# EAGLE design gate_boost (EAGLE 6.6.0)
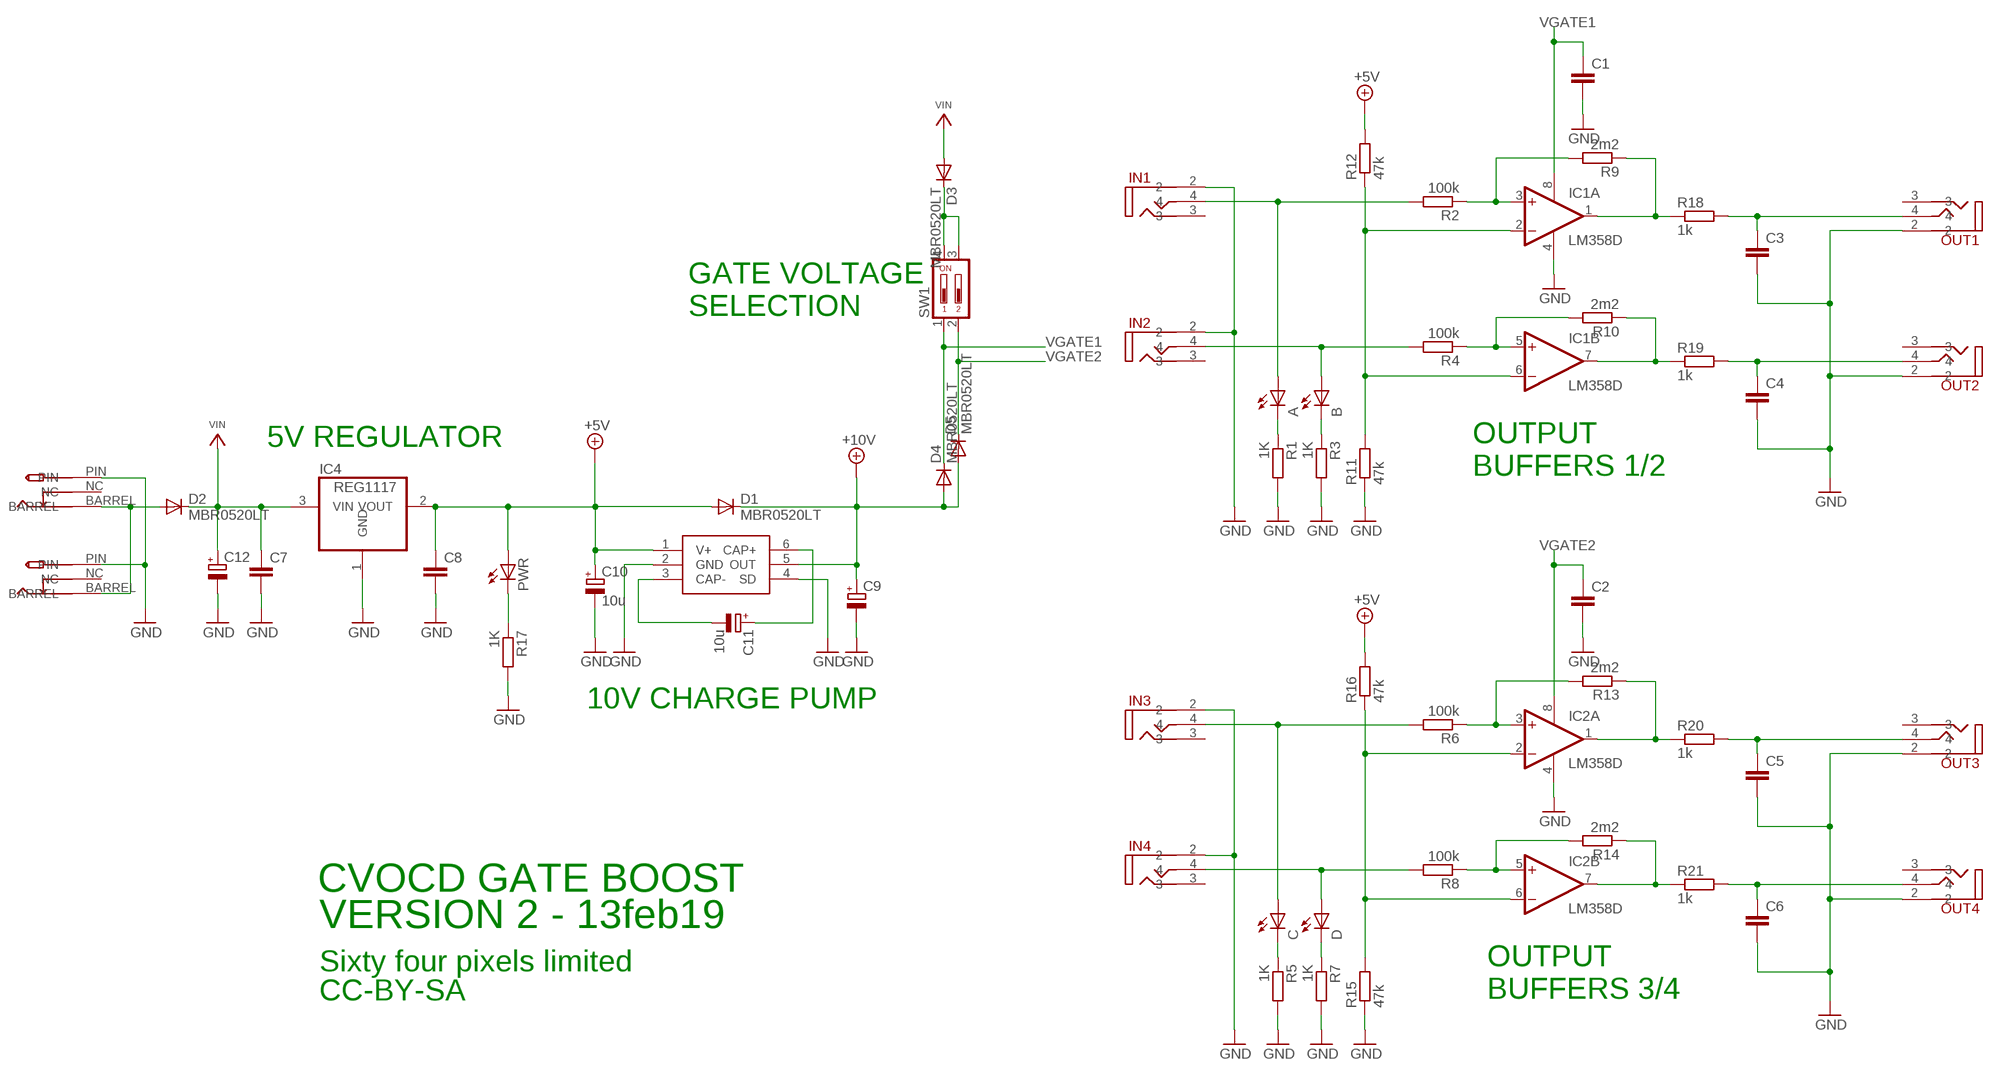
[diagram p0: schematic, sheet 1]

## Parts
A  LED3MM  [LED3MM]
B  LED3MM  [LED3MM]
C  LED3MM  [LED3MM]
C1  C-EUC0805  [C0805]
C2  C-EUC0805  [C0805]
C3  C-EUC0805  [C0805]
C4  C-EUC0805  [C0805]
C5  C-EUC0805  [C0805]
C6  C-EUC0805  [C0805]
C7  C-EUC0805  [C0805]
C8  C-EUC0805  [C0805]
C9  CPOL-EUSMCA  [SMC_A]
C10  10u  CPOL-EUSMCA  [SMC_A]
C11  10u  CPOL-EUSMCA  [SMC_A]
C12  CPOL-EUE2-5  [E2-5]
D  LED3MM  [LED3MM]
D1  MBR0520LT  [SOD123]
D2  MBR0520LT  [SOD123]
D3  MBR0520LT  [SOD123]
D4  MBR0520LT  [SOD123]
D5  MBR0520LT  [SOD123]
IC1  LM358D  [SO08]
IC2  LM358D  [SO08]
IC3  LM27675M5_CHARGEPUMP  [SOT23-6]
IC4  REG1117  [SOT223]
IN1  VERTICAL_3_5MM_SOCKET  [VERTICAL_3_5MM_SOCKET]
IN2  VERTICAL_3_5MM_SOCKET  [VERTICAL_3_5MM_SOCKET]
IN3  VERTICAL_3_5MM_SOCKET  [VERTICAL_3_5MM_SOCKET]
IN4  VERTICAL_3_5MM_SOCKET  [VERTICAL_3_5MM_SOCKET]
OUT1  VERTICAL_3_5MM_SOCKET  [VERTICAL_3_5MM_SOCKET]
OUT2  VERTICAL_3_5MM_SOCKET  [VERTICAL_3_5MM_SOCKET]
OUT3  VERTICAL_3_5MM_SOCKET  [VERTICAL_3_5MM_SOCKET]
OUT4  VERTICAL_3_5MM_SOCKET  [VERTICAL_3_5MM_SOCKET]
PWR  LED3MM  [LED3MM]
R1  1K  R-EU_R0805  [R0805]
R2  100k  R-EU_R0805  [R0805]
R3  1K  R-EU_R0805  [R0805]
R4  100k  R-EU_R0805  [R0805]
R5  1K  R-EU_R0805  [R0805]
R6  100k  R-EU_R0805  [R0805]
R7  1K  R-EU_R0805  [R0805]
R8  100k  R-EU_R0805  [R0805]
R9  2m2  R-EU_R0805  [R0805]
R10  2m2  R-EU_R0805  [R0805]
R11  47k  R-EU_R0805  [R0805]
R12  47k  R-EU_R0805  [R0805]
R13  2m2  R-EU_R0805  [R0805]
R14  2m2  R-EU_R0805  [R0805]
R15  47k  R-EU_R0805  [R0805]
R16  47k  R-EU_R0805  [R0805]
R17  1K  R-EU_R0805  [R0805]
R18  1k  R-EU_R0805  [R0805]
R19  1k  R-EU_R0805  [R0805]
R20  1k  R-EU_R0805  [R0805]
R21  1k  R-EU_R0805  [R0805]
SW1  DIP02YL  [DIP02YL]
U$1  PWR_SOCKET_2_1MM  [PWR_SOCKET_2_1MM]
U$2  PWR_SOCKET_2_1MM  [PWR_SOCKET_2_1MM]

## Nets
+5V: C8.1 C10.+ D1.A IC3.1(V+) IC4.2(VOUT) PWR.A R12.2 R16.2
+10V: C9.+ D1.C D4.A D5.A IC3.5(OUT)
GND: C1.2 C2.2 C3.2 C4.2 C5.2 C6.2 C7.2 C8.2 C9.- C10.- C12.- IC1.4(P:V-) IC2.4(P:V-) IC3.2(GND) IC3.4(SD) IC4.1(GND) IN1.2 IN2.2 IN3.2 IN4.2 OUT1.2 OUT2.2 OUT3.2 OUT4.2 R1.2 R3.2 R5.2 R7.2 R11.1 R15.1 R17.2 U$1.PIN U$2.PIN
IN1: A.A IN1.4 R2.2
IN2: B.A IN2.4 R4.2
IN3: C.A IN3.4 R6.2
IN4: D.A IN4.4 R8.2
N$1: IC1.2(A:-IN) IC1.6(B:-IN) R11.2 R12.1
N$2: A.K(C) R1.1
N$3: B.K(C) R3.1
N$4: IC1.3(A:+IN) R2.1 R9.2
N$5: IC1.5(B:+IN) R4.1 R10.2
N$6: D3.C SW1.3 SW1.4
N$7: C5.1 OUT3.4 R20.2
N$8: C6.1 OUT4.4 R21.2
N$9: IC1.1(A:OUT) R9.1 R18.1
N$10: IC2.7(B:OUT) R14.1 R21.1
N$11: IC2.1(A:OUT) R13.1 R20.1
N$12: IC1.7(B:OUT) R10.1 R19.1
N$13: IC2.2(A:-IN) IC2.6(B:-IN) R15.2 R16.1
N$14: C.K(C) R5.1
N$15: D.K(C) R7.1
N$16: IC2.3(A:+IN) R6.1 R13.2
N$17: IC2.5(B:+IN) R8.1 R14.2
N$19: C3.1 OUT1.4 R18.2
N$20: C4.1 OUT2.4 R19.2
N$21: D2.A U$1.BARREL U$2.BARREL
N$23: PWR.K(C) R17.1
N$38: C11.+ IC3.6(CAP+)
N$39: C11.- IC3.3(CAP-)
VGATE1: C1.1 D4.C IC1.8(P:V+) SW1.1
VGATE2: C2.1 D5.C IC2.8(P:V+) SW1.2
VIN: C7.1 C12.+ D2.C D3.A IC4.3(VIN)
Unconnected: IN1.3 IN2.3 IN3.3 IN4.3 OUT1.3 OUT2.3 OUT3.3 OUT4.3 U$1.NC U$2.NC

## Notes on the sheet
- GATE VOLTAGE 
  SELECTION
- 5V REGULATOR
- OUTPUT 
  BUFFERS 1/2
- 10V CHARGE PUMP
- CVOCD GATE BOOST
- VERSION 2 - 13feb19
- Sixty four pixels limited
- OUTPUT 
  BUFFERS 3/4
- CC-BY-SA

## Library data of the parts
A B C D PWR = led:LED: LED OSRAM: - CHIPLED LG R971, LG N971, LY N971, LG Q971, LY Q971, LO R971, LY R971 LH N974, LH R974 LS Q976, LO Q976, LY Q976 LO Q996 - Hyper CHIPLED LW Q18S LB Q993, LB Q99A, LB R99A - SideLED LS A670, LO A670, LY A670, LG A670, LP A670 LB A673, LV A673, LT A673, LW A673 LH A674 LY A675 LS A676, LA A676, LO A676, LY A676, LW A676 LS A679, LY A679, LG A679 - Hyper Micro SIDELED® LS Y876, LA Y876, LO Y876, LY Y876 LT Y87S - SmartLED LW L88C, LW L88S LB L89C, LB L89S, LG L890 LS L89K, LO L89K, LY L89K LS L896, LA L896, LO L896, LY L896 - TOPLED LS T670, LO T670, LY T670, LG T670, LP T670 LSG T670, LSP T670, LSY T670, LOP T670, LYG T670 LG T671, LOG T671, LSG T671 LB T673, LV T673, LT T673, LW T673 LH T674 LS T676, LA T676, LO T676, LY T676, LB T676, LH T676, LSB T676, LW T676 LB T67C, LV T67C, LT T67C, LS T67K, LO T67K, LY T67K, LW E67C LS E67B, LA E67B, LO E67B, LY E67B, LB E67C, LV E67C, LT E67C LW T67C LS T679, LY T679, LG T679 LS T770, LO T770, LY T770, LG T770, LP T770 LB T773, LV T773, LT T773, LW T773 LH T774 LS E675, LA E675, LY E675, LS T675 LS T776, LA T776, LO T776, LY T776, LB T776 LHGB T686 LT T68C, LB T68C - Hyper Mini TOPLED® LB M676 - Mini TOPLED Santana® LG M470 LS M47K, LO M47K, LY M47K Source: http://www.osram.convergy.de LUXEON: - LUMILED® LXK2-PW12-R00, LXK2-PW12-S00, LXK2-PW14-U00, LXK2-PW14-V00 LXK2-PM12-R00, LXK2-PM12-S00, LXK2-PM14-U00 LXK2-PE12-Q00, LXK2-PE12-R00, LXK2-PE12-S00, LXK2-PE14-T00, LXK2-PE14-U00 LXK2-PB12-K00, LXK2-PB12-L00, LXK2-PB12-M00, LXK2-PB14-N00, LXK2-PB14-P00, LXK2-PB14-Q00 LXK2-PR12-L00, LXK2-PR12-M00, LXK2-PR14-Q00, LXK2-PR14-R00 LXK2-PD12-Q00, LXK2-PD12-R00, LXK2-PD12-S00 LXK2-PH12-R00, LXK2-PH12-S00 LXK2-PL12-P00, LXK2-PL12-Q00, LXK2-PL12-R00 Source: www.luxeon.com KINGBRIGHT: KA-3528ASYC Source: www.kingbright.com
C1-C8 = resistor:C-EU: CAPACITOR, European symbol
C9-C12 = rcl:CPOL-EU: POLARIZED CAPACITOR, European symbol
D1-D5 = diode:MBR0520LT: SCHOTTKY BARRIER RECTIFIER Source: http://onsemi.com .. MBR0520LT1-D.pdf
IC1 IC2 = linear:LM358: OP AMP also LM158; LM258; LM2904 Source: http://cache.national.com/ds/LM/LM158.pdf
IC3 = jason_eagle6:LM27675M5_CHARGEPUMP
IC4 = burr-brown:REG1117: 800mA and 1A Low Dropout (LDO) Positive Regulator 1.8V, 2.5V, 2.85V, 3.3V, 5V, and Adj; MPN: REG1117; OC_FARNELL: 1097566; OC_NEWARK: 14P6981
IN1-IN4 OUT1-OUT4 = jason_eagle6:VERTICAL_3_5MM_SOCKET
R1-R21 = rcl:R-EU_: RESISTOR, European symbol
SW1 = switch-dil:DIP02YL: DIL/CODE SWITCH; OC_FARNELL: unknown; OC_NEWARK: unknown
U$1 U$2 = jason_eagle6:PWR_SOCKET_2_1MM

## Board
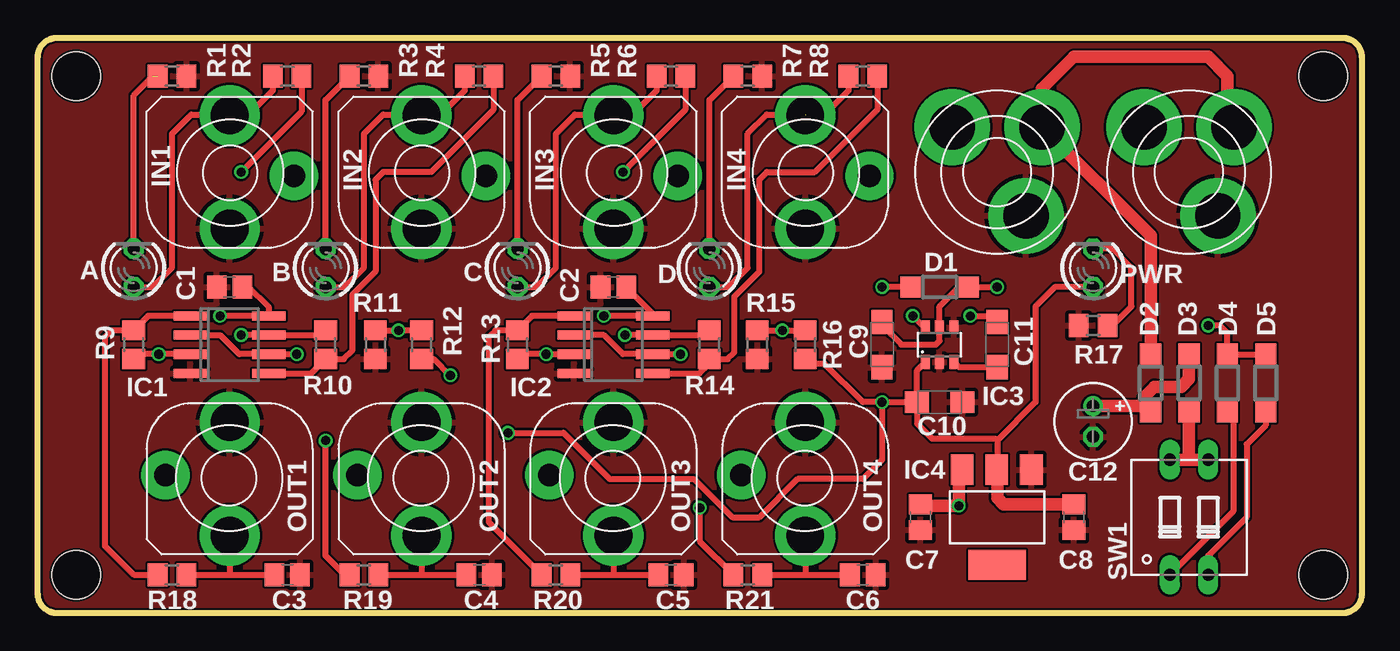
[diagram p1: board, top side]
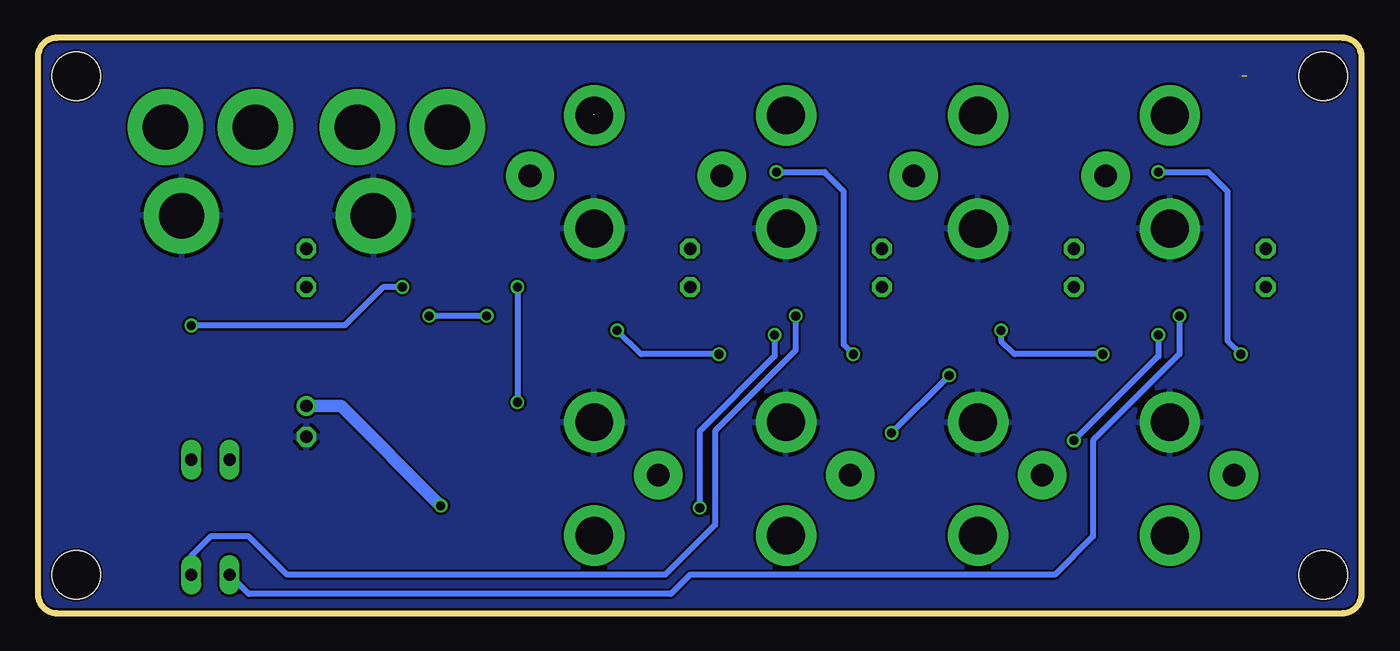
[diagram p2: board, bottom side, seen from below]

Size 87.63 x 38.1 mm. Coordinates in mm from the lower left corner, seen from the top.
Outline: 0,36.83 arc-90 1.27,38.1 86.36,38.1 arc-90 87.63,36.83 87.63,1.27 arc-90 86.36,0 1.27,0 arc-90 0,1.27 0,36.83
Copper layers (1*16): Top 0.035mm / dielectric 1.5mm / Bottom 0.035mm
Design rules "hackvana": minimum track width 6mil, minimum drill 0.3mm, track to track 6mil, track to pad 9mil, pad to pad 6mil, via to via 6mil, smd to smd 0mil, copper to edge 6mil, drill to drill 6mil, minimum pad ring 10mil, minimum via ring 6mil, stop-mask expansion 2mil, vias tented up to drill 100mil, thermal gap 10mil
Holes 3.2 mm at 85.09,35.56 2.54,35.56 2.54,2.54 85.09,2.54

### Footprints (pad centres in the part's own frame; a part is rotated, then mirrored left to right if it is on the bottom)
LED3MM = drill 0.813 octagon: A -1.27,0; K 1.27,0
C0805 = smd 1.3 x 1.5: 1 -0.85,0; 2 0.85,0
SMC_A = smd 1.6 x 1.4: + -1.5,0; - 1.5,0
E2-5 = drill 0.813 pad 1.27: + -1.016,0 | drill 0.813 pad 1.27 octagon: - 1.016,0
SOD123 = smd 1.4 x 1.4: A 1.9,0; C -1.9,0
SO08 = smd 0.6 x 2.2: 1 -1.905,-2.6; 2 -0.635,-2.6; 3 0.635,-2.6; 4 1.905,-2.6; 5 1.905,2.6; 6 0.635,2.6; 7 -0.635,2.6; 8 -1.905,2.6
SOT23-6 = smd 0.6 x 0.9: 1 -0.95,-1.15; 2 0,-1.15; 3 0.95,-1.15; 4 0.95,1.15; 5 0,1.15; 6 -0.95,1.15
SOT223 = smd 1.499 x 2.007: 1 -2.261,-3.15; 2 0.025,-3.15; 3 2.311,-3.15 | smd 3.81 x 2.007: 4 0,3.15
VERTICAL_3_5MM_SOCKET = drill 2.5 pad 4: 2 0,-3.75; 4 0,3.75 | drill 1.5 pad 3.2: 3 4.25,-0.25
R0805 = smd 1.3 x 1.5: 1 -0.95,0; 2 0.95,0
DIP02YL = drill 0.813 long: 1 -1.27,-3.81; 2 1.27,-3.81; 3 1.27,3.81; 4 -1.27,3.81
PWR_SOCKET_2_1MM = drill 3 pad 5: BARREL 0,4.2; NC -4.2,0; PIN 3.4,-0.7

### Placement (x,y rotation side)
A  6.35,22.86 90 top
B  19.05,22.86 90 top
C  31.75,22.86 90 top
C1  12.7,21.59 180 top
C2  38.1,21.59 180 top
C3  16.51,2.54 0 top
C4  29.21,2.54 0 top
C5  41.91,2.54 0 top
C6  54.61,2.54 0 top
C7  58.42,6.35 270 top
C8  68.58,6.35 270 top
C9  55.88,17.78 270 top
C10  59.69,13.97 0 top
C11  63.5,17.78 270 top
C12  69.85,12.7 270 top
D  44.45,22.86 90 top
D1  59.69,21.59 180 top
D2  73.66,15.24 90 top
D3  76.2,15.24 90 top
D4  78.74,15.24 90 top
D5  81.28,15.24 90 top
IC1  12.7,17.78 270 top
IC2  38.1,17.78 270 top
IC3  59.69,17.78 0 top
IC4  63.5,6.35 180 top
IN1  12.7,29.21 0 top
IN2  25.4,29.21 0 top
IN3  38.1,29.21 0 top
IN4  50.8,29.21 0 top
OUT1  12.7,8.89 180 top
OUT2  25.4,8.89 180 top
OUT3  38.1,8.89 180 top
OUT4  50.8,8.89 180 top
PWR  69.85,22.86 90 top
R1  8.89,35.56 0 top
R2  16.51,35.56 180 top
R3  21.59,35.56 0 top
R4  29.21,35.56 180 top
R5  34.29,35.56 0 top
R6  41.91,35.56 180 top
R7  46.99,35.56 0 top
R8  54.61,35.56 180 top
R9  6.35,17.78 270 top
R10  19.05,17.78 270 top
R11  22.35,17.78 90 top
R12  25.4,17.78 270 top
R13  31.75,17.78 270 top
R14  44.45,17.78 270 top
R15  47.62,17.78 90 top
R16  50.8,17.78 270 top
R17  69.85,19.05 180 top
R18  8.89,2.54 0 top
R19  21.59,2.54 0 top
R20  34.29,2.54 0 top
R21  46.99,2.54 0 top
SW1  76.2,6.35 0 top
U$1  63.5,29.21 315 top
U$2  76.2,29.21 315 top

### Tracks (layer width: path | path; a pad name or v marks a point on that pad's centre or on a via)
+5V  (via drill 0.6)
  Top 0.406: R12.2 26.22,16.83 v27.3,15.75 | v31.11,11.94 34.8,11.94 37.85,8.89 43.43,8.89 45.97,6.35 47.75,6.35 50.29,8.89 54.61,8.89 55.88,10.16 v55.88,13.97 | C10.+ 58.19,16.08 IC3.1 | D1.A v55.88,21.59 | v55.88,13.97 C10.+ | PWR.A 67.31,21.59 66.04,20.32 66.04,13.97 63.5,11.43 | 63.5,11.43 63.5,9.53 IC4.2 | C10.+ 58.19,12.55 59.18,11.56 63.37,11.56 63.5,11.43 | v55.88,13.97 54.61,13.97 52.07,16.51 51.12,16.51 R16.2
  Top 0.813: C8.1 63.92,7.2 63.5,7.62 63.5,9.47 IC4.2
  Bottom 0.406: v27.3,15.75 v31.11,11.94 | v55.88,21.59 v55.88,13.97
+10V  (via drill 0.6)
  Top 0.406: C9.+ 55.88,19.05 57.15,17.78 59.44,17.78 59.69,18.03 IC3.5 59.69,20.32 60.96,21.59 D1.C v63.5,21.59 | D5.A D4.A 78.74,18.54 78.23,19.05 v77.47,19.05
  Bottom 0.406: v63.5,21.59 64.77,21.59 67.31,19.05 v77.47,19.05
GND
  pour Top: -1.27,39.37 -1.27,-1.27 88.9,-1.27 88.9,39.37
  pour Bottom: -1.27,39.37 -1.27,-1.27 88.9,-1.27 88.9,39.37
IN1
  Top 0.406: A.A 7.62,21.59 8.89,22.86 8.89,31.75 10.16,33.02 12.64,33.02 IN1.4 13.91,32.96 15.56,34.61 R2.2
IN2
  Top 0.406: B.A 20.32,21.59 21.59,22.86 21.59,31.75 22.86,33.02 25.34,33.02 IN2.4 25.46,33.02 26.67,33.02 28.26,34.61 R4.2
IN3
  Top 0.406: C.A 33.02,21.59 34.29,22.86 34.29,31.75 35.56,33.02 38.04,33.02 IN3.4 38.16,33.02 39.37,33.02 40.96,34.61 R6.2
IN4  (1 unrouted)
  Top 0.406: D.A 45.72,21.59 46.99,22.86 46.99,31.75 48.26,33.02 50.8,33.02 | R8.2 53.66,34.61 52.07,33.02 50.86,33.02 IN4.4
N$1  (via drill 0.6)
  Top 0.406: IC1.2 12.07,18.41 13.34,17.14 IC1.6 v17.14,17.14 | R11.2 v23.88,18.73 R12.1
  Bottom 0.406: v23.88,18.73 23.88,18.03 22.99,17.14 v17.14,17.14
N$2  (1 unrouted)
  Top 0.406: A.K 6.35,34.29 7.62,35.56
N$3
  Top 0.406: B.K 19.05,33.97 R3.1
N$4  (via drill 0.6)
  Top 0.406: IC1.3 v8,17.14 6.67,17.14 R9.2 | R2.1 17.46,33.21 v13.46,29.21
  Bottom 0.406: v13.46,29.21 10.16,29.21 8.89,27.94 8.89,18.03 v8,17.14
N$5
  Top 0.406: IC1.5 18.09,15.88 R10.2 20.26,16.83 20.83,17.4 20.83,21.08 22.35,22.61 22.35,28.7 22.86,29.21 26.04,29.21 30.16,33.33 R4.1
N$6
  Top 0.813: SW1.3 76.2,10.16 | 76.2,10.16 SW1.4 | D3.C 76.2,10.16
N$7
  Top 0.406: R20.2 38.1,2.54 | 38.1,2.54 C5.1 | OUT3.4 38.1,2.54
N$8
  Top 0.406: R21.2 50.8,2.54 | 50.8,2.54 C6.1 | OUT4.4 50.8,2.54
N$9
  Top 0.406: IC1.1 7.3,19.68 R9.1 4.89,18.73 4.45,18.29 4.45,4.45 6.35,2.54 R18.1
N$10  (via drill 0.6)
  Top 0.406: R14.1 44.13,18.41 IC2.7 v38.86,18.41 | v43.81,6.98 43.81,4.77 R21.1
  Bottom 0.406: v38.86,18.41 38.86,17.02 43.81,12.07 v43.81,6.98
N$11
  Top 0.406: IC2.1 32.7,19.68 R13.1 30.29,18.73 29.84,18.29 29.84,6.04 R20.1
N$12  (via drill 0.6)
  Top 0.406: R10.1 18.73,18.41 IC1.7 v13.46,18.41 | R19.1 20.32,2.54 19.05,3.81 v19.05,11.43
  Bottom 0.406: v13.46,18.41 13.46,17.02 v19.05,11.43
N$13  (via drill 0.6)
  Top 0.406: R15.2 v49.28,18.73 R16.1 | v42.55,17.14 IC2.6 38.73,17.14 37.46,18.41 IC2.2
  Bottom 0.406: v42.55,17.14 47.69,17.14 v49.28,18.73
N$14
  Top 0.406: C.K 31.75,33.97 R5.1
N$15
  Top 0.406: D.K 44.45,33.97 R7.1
N$16  (via drill 0.6)
  Top 0.406: R6.1 42.86,33.33 v38.73,29.21 | IC2.3 v33.66,17.14 32.06,17.14 R13.2
  Bottom 0.406: v38.73,29.21 35.56,29.21 34.29,27.94 34.29,17.78 v33.66,17.14
N$17
  Top 0.406: IC2.5 43.81,15.88 44.45,16.51 R14.2 45.66,16.83 46.1,17.27 46.1,20.96 47.75,22.61 47.75,28.7 48.26,29.21 51.44,29.21 55.56,33.33 R8.1
N$19
  Top 0.406: R18.2 12.7,2.54 | 12.7,2.54 C3.1 | OUT1.4 12.7,2.54
N$20
  Top 0.406: R19.2 25.4,2.54 | 25.4,2.54 C4.1 | OUT2.4 25.4,2.54
N$21
  Top 0.813: U$2.BARREL 78.74,32.61 78.74,35.56 77.47,36.83 68.58,36.83 66.47,34.72 U$1.BARREL 73.66,24.99 D2.A
N$23
  Top 0.406: R17.1 71.12,19.05 72.39,20.32 72.39,22.86 71.12,24.13 PWR.K
N$38  (via drill 0.6)
  Top 0.406: IC3.6 58.67,18.93 v57.91,19.68 | v61.72,19.68 63.09,19.68 C11.+
  Bottom 0.406: v57.91,19.68 v61.72,19.68
N$39
  Top 0.406: C11.- 60.99,16.28 IC3.3
VGATE1  (via drill 0.6)
  Top 0.406: C1.1 13.97,21.59 15.3,20.26 IC1.8 v12.07,19.68 | SW1.1 79.12,6.73 79.12,12.96 D4.C
  Bottom 0.406: v12.07,19.68 12.07,17.14 17.78,11.43 17.78,5.08 20.32,2.54 44.45,2.54 45.72,1.27 73.66,1.27 SW1.1
VGATE2  (via drill 0.6)
  Top 0.406: C2.1 40.7,19.84 IC2.8 v37.46,19.68 | SW1.2 77.47,3.81 80.01,6.35 80.01,11.18 81.28,12.45 D5.C
  Bottom 0.406: v37.46,19.68 37.46,17.4 42.8,12.07 42.8,5.84 46.1,2.54 71.12,2.54 73.66,5.08 76.2,5.08 77.47,3.81 SW1.2
VIN  (via drill 0.6)
  Top 0.813: C7.1 58.51,7.11 v60.96,7.11 60.96,9.27 IC4.3 | C12.+ 73.28,13.72 | 73.28,13.72 D2.C | 73.28,13.72 73.28,14.36 73.91,14.99 75.69,14.99 76.2,15.49 D3.A
  Bottom 0.813: C12.+ 67.56,13.72 v60.96,7.11

### Text on the board
tDocu: CV.OCD Gate Boost v2 | six4pix.com/cvocd